# Altium schematic sheet Managment PCB.SchDoc
size A3
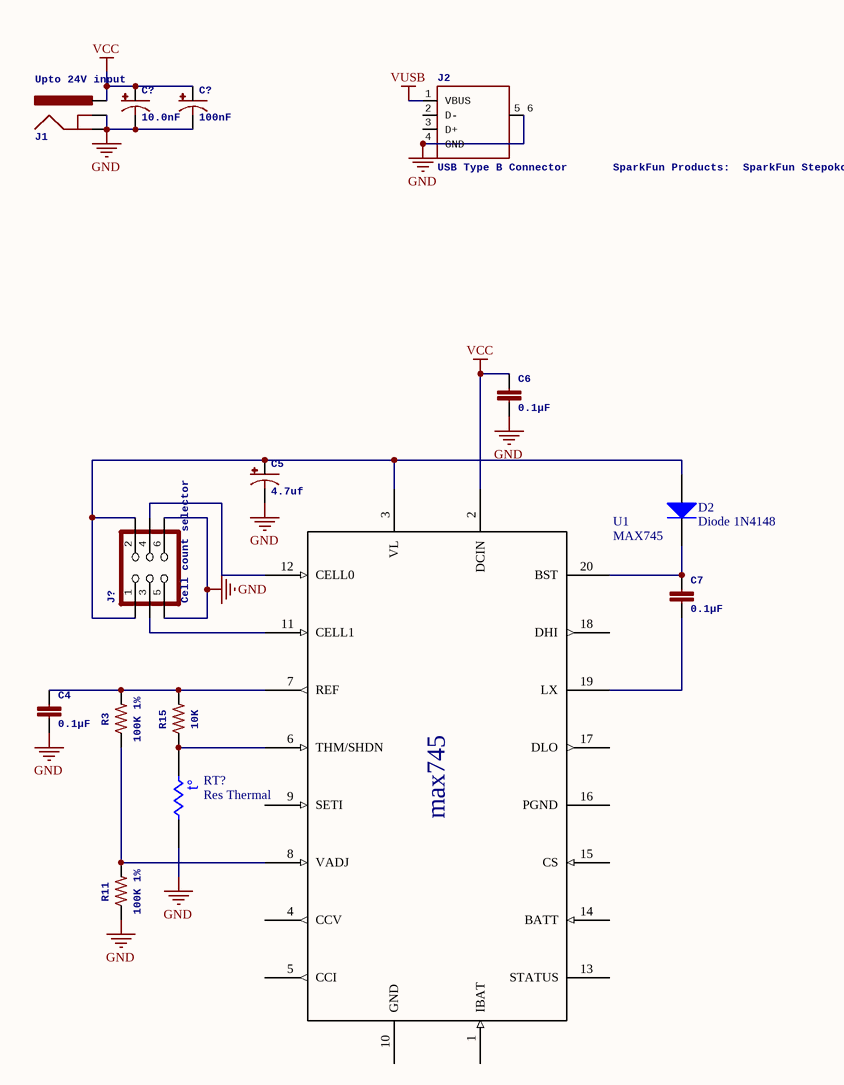
[diagram p0: Managment PCB.SchDoc]

## Parts
(Parts that share a designator on the sheet are numbered #1, #2 ... from top to bottom, then left to right.)
C4  0.1µF  [CAP-PTH-SMALL-KIT]
C5  4.7uf  [CPOL-RADIAL-2.5MM-5MM-KIT]
C6  0.1µF  [CAP-PTH-SMALL-KIT]
C7  0.1µF  [CAP-PTH-SMALL-KIT]
C?#1  10.0nF  [CPOL-RADIAL-2.5MM-5MM-KIT]
C?#2  100nF  [CPOL-RADIAL-2.5MM-5MM-KIT]
D2  Diode 1N4148  [DO-35]
J1  Upto 24V input  [POWER_JACK_PTH]
J2  USB Type B Connector       SparkFun Products:  SparkFun Stepoko PTH  [USB_B_VERTICAL_PTH]
J?  Cell count selector  [2X3_LOCK]
R3  100K 1%  [AXIAL-0.3]
R11  100K 1%  [AXIAL-0.3]
R15  10K  [AXIAL-0.3]
RT?  Res Thermal  [AXIAL-0.1]
U1  MAX745  [MAX745]

## Nets
GND: C4.2 C5.2(-) C6.2 C?#1.2(-) C?#2.2(-) J1.GND J1.GNDBREAK J2.4(GND) J2.5_6(SHIELD) J?.5 J?.6 R11.P$1 RT?.2
VCC: C6.1 C?#1.1(+) C?#2.1(+) J1.PWR U1.2(DCIN)
VUSB: J2.1(VBUS)
NetC4_1: C4.1 R3.P$2 R15.P$2 U1.7(REF)
NetC5_1: C5.1(+) D2.1(A) J?.1 J?.2 U1.3(VL)
NetC7_1: C7.1 D2.2(K) U1.20(BST)
NetC7_2: C7.2 U1.19(LX)
NetJ?_3: J?.3 U1.11(CELL1)
NetJ?_4: J?.4 U1.12(CELL0)
NetR3_P$1: R3.P$1 R11.P$2 U1.8(VADJ)
NetR15_P$1: R15.P$1 RT?.1 U1.6(THM/SHDN)

Not connected (* = marked no-connect by the designer): J2 2(D-) 3(D+); U1 1(IBAT) 4(CCV) 5(CCI) 9(SETI) 10(GND) 13(STATUS) 14(BATT) 15(CS) 16(PGND) 17(DLO) 18(DHI)

## Notes on the sheet
- (in symbol Component_1) max745
- (in symbol Res Thermal) t°

## Library data of the parts
C4 C6 C7 = 0.1UF-KIT-EZ-50V-20%: PROD_ID: CAP-08370
C5 C?#1 C?#2 = 10UF-POLAR-RADIAL-2.5MM-KIT-25V-20%: PROD_ID: CAP-08440
D2 = Diode 1N914: High Conductance Fast Diode; Published: 8-Jun-2000; LatestRevisionDate: 17-Jul-2002; LatestRevisionNote: Re-released for DXP Platform.; DatasheetVersion: 1997; PackageReference: DO-35; Publisher: Altium Limited; PackageDescription: Diode, Axial; Body 3.8 x 1.9 mm (LxDia. max), Lead Dia. 0.53 mm (max); Code_JEDEC: DO-204-AH; ComponentLink1Description: Manufacturer Link; ComponentLink1URL: http://www.fairchildsemi.com/; ComponentLink2Description: Datasheet; ComponentLink2URL: http://www.fairchildsemi.com/ds/1N%2F1N4448.pdf
J1 = POWER_JACK: PROD_ID: CONN-08197
J2 = USB_B_VERTICAL
J? = AVR_SPI_PROG_3X22X3_LOCK
R3 R11 R15 = 1KOHM-HORIZ-1/4W-1%: PROD_ID: RES-12182
RT? = Res Thermal: Thermistor; Published: 24-Mar-1999; LatestRevisionDate: 29-May-2009; LatestRevisionNote: IPC-7351 Footprint Added.; PackageVersion: Mar-2003; PackageReference: 6-0805; Publisher: Altium Limited; PackageDescription: Chip Resistor 0805 Case Size; Code_IPC: RESC2012
U1 = Component_1: 20 SSOP MAXIM Battery managment chip; DatasheetVersion: 19-1182; Rev 3; 10/01; PackageReference: 20 pin SSOP; PackageDescription: 20 pin SSOP package; ComponentLink1Description: https://www.maximintegrated.com/en/products/power/battery-management/MAX745.html; ComponentLink1URL: https://www.maximintegrated.com/; ComponentLink2Description: https://datasheets.maximintegrated.com/en/ds/MAX745.pdf